# Altium schematic sheet TLV755P_3V3.SchDoc
size A4; SheetNumber: 10; SheetTotal: 27
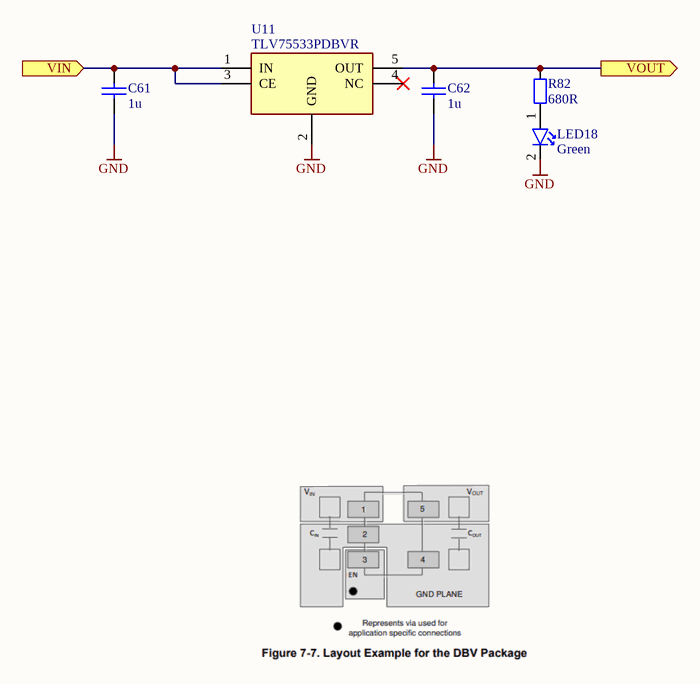
[diagram p0: TLV755P_3V3.SchDoc]

## Parts
C61  1u  [C_0603_1608Metric_IPC_N]
C62  1u  [C_0603_1608Metric_IPC_N]
LED18  Green  [LED_0603_1806Metric_IPC_N]
R82  680R  [R_0402_1005Metric_IPC_N]
U11  TLV75533PDBVR  [SOT-23-5]

## Ports
VIN (in, see Power_Supply[5C], LT3042_3V3[2B], LT3045_3V3[2B], XC6204_1V8[2B]), VOUT (out, see Power_Supply[6C])

## Nets
GND: C61.1 C62.1 LED18.2 U11.2(GND)
VIN: C61.2 U11.1(IN) U11.3(CE) ; port VIN
VOUT: C62.2 R82.1 U11.5(OUT) ; port VOUT
NetLED18_1: LED18.1 R82.2

Not connected (* = marked no-connect by the designer): U11 4(NC)*

## Library data of the parts
C61 C62 = C000003: Generic MLCC with 0603 Footprint; Specific Component: False; Temp Coefficient: X7R; Voltage Rated: 15V; ID: C000003; Capacitance: 1u; Tolerance: *; min Temperature: *; max Temperature: *; Case: 0603
LED18 = LED000007: MLCC, Low Current, Green, 2.2V, 20mA, 0603; Manufacturer: Broadcom / Avago; Manufacturer Part Number: HSMG-C190; Specific Component: True; ID: LED000007; Type: Low Current; Colour: Green; Forward Voltage: 2.2V; Current: 20mA; Case: 0603; ComponentLink1Description: Datasheet; ComponentLink1URL: https://www.mouser.de/datasheet/3/57/1/AV02_0551EN_DS_HSMx_Cxxx_25Mar2022.pdf; Supplier 1: Mouser; Supplier Part Number 1: 630-HSMG-C190; Supplier 2: Digikey; Supplier Part Number 2: 516-1425-1-ND
R82 = R000002: Generic Chip Resistor with 0402 Footprint; Specific Component: False; ID: R000002; Resistance: 680R; Tolerance: *; Power Rating: *; Composition: *; min Temperature: *; max Temperature: *; Temp Coefficient: *; Case: 0402
U11 = PMIC000031: Manufacturer: Texas Instruments; ID: PMIC000031; Type: LDO; Manufacturer Part Number: TLV75533PDBVR; Part Value: TLV75533PDBVR; Case: SOT-23-5; ComponentLink1Description: Datasheet; ComponentLink1URL: https://www.ti.com/lit/ds/symlink/tlv755p.pdf?ts=1770973910931&ref_url=https%253A%252F%252Fwww.ti.com%252Fproduct%252FTLV755P%252Fpart-details%252FTLV75533PDRVR%253Futm_source%253Dgoogle%2526utm_medium%253Dcpc%2526utm_campaign%253Dapp-null-null-app_opn_en-cpc-storeic-google-eu_en_pur%2526utm_content%253DDevice%2526ds_k%253DTLV75533PDRVR%2526DCM%253Dyes%2526gclsrc%253Daw.ds%2526gad_source%253D1%2526gad_campaignid%253D18945642618%2526gbraid%253D0AAAAAC068F2EIKSMGn-IP6GsPs7bTaxyC%2526gclid%253DCjwKCAiAtLvMBhB_EiwA1u6_PkK8PpmP893KdmBSOr6UVtpkHgVfO7G8NLTFaKf8hjJC2576AnUZ2RoCVqoQAvD_BwE; Supplier 1: Digikey; Supplier Part Number 1: 296-50411-1-ND; Supplier 2: Mouser; Supplier Part Number 2: 595-TLV75533PDBVR